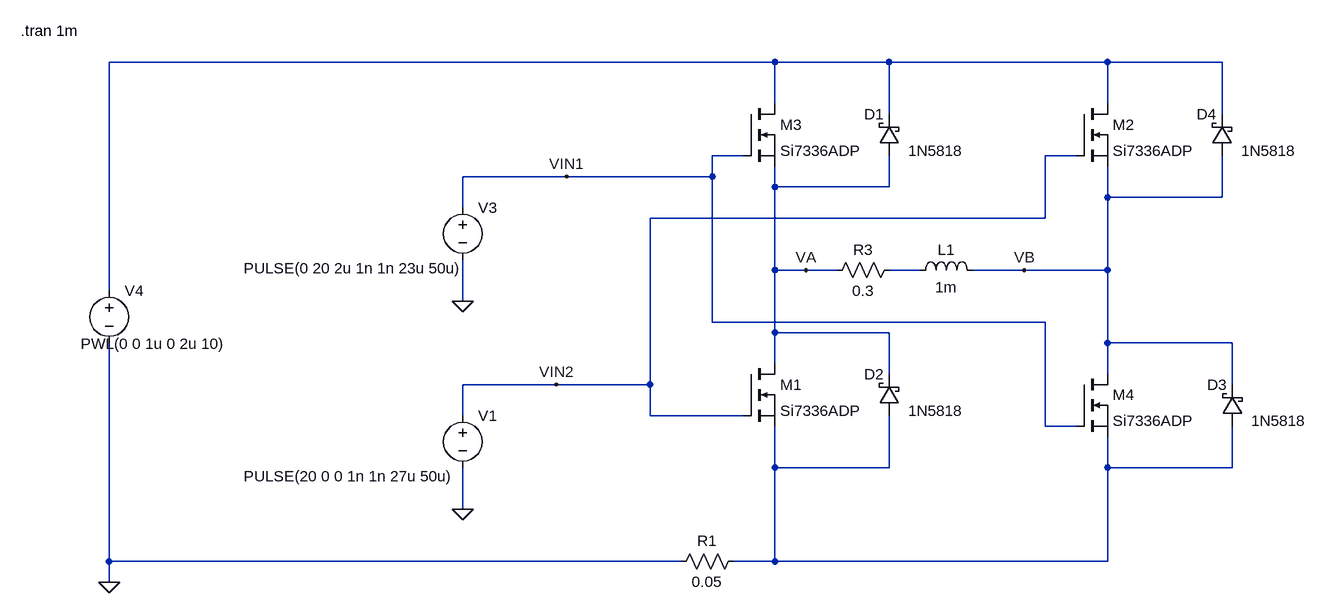
[diagram p0: schematic rl_pwm.asc]
rl_pwm.asc, the LTspice schematic file:
Version 4
SHEET 1 3012 680
WIRE 2192 -240 1168 -240
WIRE 2368 -240 2192 -240
WIRE 2704 -240 2368 -240
WIRE 2880 -240 2704 -240
WIRE 2192 -176 2192 -240
WIRE 2704 -176 2704 -240
WIRE 2368 -160 2368 -240
WIRE 2880 -160 2880 -240
WIRE 2144 -96 2096 -96
WIRE 2656 -96 2608 -96
WIRE 1872 -64 1712 -64
WIRE 2096 -64 2096 -96
WIRE 2096 -64 1872 -64
WIRE 2192 -48 2192 -80
WIRE 2368 -48 2368 -96
WIRE 2368 -48 2192 -48
WIRE 2704 -32 2704 -80
WIRE 2880 -32 2880 -96
WIRE 2880 -32 2704 -32
WIRE 1712 -16 1712 -64
WIRE 2608 0 2608 -96
WIRE 2608 0 2000 0
WIRE 2192 80 2192 -48
WIRE 2240 80 2192 80
WIRE 2288 80 2240 80
WIRE 2416 80 2368 80
WIRE 2576 80 2496 80
WIRE 2704 80 2704 -32
WIRE 2704 80 2576 80
WIRE 1168 112 1168 -240
WIRE 1712 128 1712 64
WIRE 2096 160 2096 -64
WIRE 2608 160 2096 160
WIRE 2192 176 2192 80
WIRE 2368 176 2192 176
WIRE 2704 192 2704 80
WIRE 2896 192 2704 192
WIRE 2192 224 2192 176
WIRE 2368 240 2368 176
WIRE 2704 240 2704 192
WIRE 1856 256 1712 256
WIRE 2000 256 2000 0
WIRE 2000 256 1856 256
WIRE 2896 256 2896 192
WIRE 1712 304 1712 256
WIRE 2000 304 2000 256
WIRE 2144 304 2000 304
WIRE 2608 320 2608 160
WIRE 2656 320 2608 320
WIRE 2192 384 2192 320
WIRE 2368 384 2368 304
WIRE 2368 384 2192 384
WIRE 2704 384 2704 336
WIRE 2896 384 2896 320
WIRE 2896 384 2704 384
WIRE 1712 448 1712 384
WIRE 1168 528 1168 192
WIRE 2048 528 1168 528
WIRE 2192 528 2192 384
WIRE 2192 528 2128 528
WIRE 2704 528 2704 384
WIRE 2704 528 2192 528
WIRE 1168 560 1168 528
FLAG 1712 128 0
FLAG 1168 560 0
FLAG 2240 80 VA
FLAG 2576 80 VB
FLAG 1872 -64 VIN1
FLAG 1712 448 0
FLAG 1856 256 VIN2
SYMBOL voltage 1712 -32 R0
WINDOW 3 -337 109 Left 2
WINDOW 123 0 0 Left 0
WINDOW 39 0 0 Left 0
SYMATTR Value PULSE(0 20 2u 1n 1n 23u 50u)
SYMATTR InstName V3
SYMBOL nmos 2656 240 R0
SYMATTR InstName M4
SYMATTR Value Si7336ADP
SYMBOL res 2384 64 R90
WINDOW 0 0 56 VBottom 2
WINDOW 3 32 56 VTop 2
SYMATTR InstName R3
SYMATTR Value 0.3
SYMBOL voltage 1168 96 R0
WINDOW 3 -44 97 Left 2
WINDOW 123 0 0 Left 0
WINDOW 39 0 0 Left 0
SYMATTR Value PWL(0 0 1u 0 2u 10)
SYMATTR InstName V4
SYMBOL nmos 2144 -176 R0
SYMATTR InstName M3
SYMATTR Value Si7336ADP
SYMBOL ind 2400 96 R270
WINDOW 0 32 56 VTop 2
WINDOW 3 5 56 VBottom 2
SYMATTR InstName L1
SYMATTR Value 1m
SYMBOL res 2144 512 R90
WINDOW 0 0 56 VBottom 2
WINDOW 3 32 56 VTop 2
SYMATTR InstName R1
SYMATTR Value 0.05
SYMBOL nmos 2144 224 R0
SYMATTR InstName M1
SYMATTR Value Si7336ADP
SYMBOL nmos 2656 -176 R0
SYMATTR InstName M2
SYMATTR Value Si7336ADP
SYMBOL voltage 1712 288 R0
WINDOW 3 -337 109 Left 2
WINDOW 123 0 0 Left 0
WINDOW 39 0 0 Left 0
SYMATTR Value PULSE(20 0 0 1n 1n 27u 50u)
SYMATTR InstName V1
SYMBOL schottky 2384 -96 R180
WINDOW 0 24 64 Left 2
WINDOW 3 -98 8 Left 2
SYMATTR InstName D1
SYMATTR Value 1N5818
SYMATTR Description Diode
SYMATTR Type diode
SYMBOL schottky 2384 304 R180
WINDOW 0 24 64 Left 2
WINDOW 3 -98 8 Left 2
SYMATTR InstName D2
SYMATTR Value 1N5818
SYMATTR Description Diode
SYMATTR Type diode
SYMBOL schottky 2912 320 R180
WINDOW 0 24 64 Left 2
WINDOW 3 -98 8 Left 2
SYMATTR InstName D3
SYMATTR Value 1N5818
SYMATTR Description Diode
SYMATTR Type diode
SYMBOL schottky 2896 -96 R180
WINDOW 0 24 64 Left 2
WINDOW 3 -98 8 Left 2
SYMATTR InstName D4
SYMATTR Value 1N5818
SYMATTR Description Diode
SYMATTR Type diode
TEXT 1032 -288 Left 2 !.tran 1m

The netlist it stands for:
* rl_pwm.asc
V3 VIN1 0 PULSE(0 20 2u 1n 1n 23u 50u)
M4 VB VIN1 N003 N003 Si7336ADP
R3 N002 VA 0.3
V4 N001 0 PWL(0 0 1u 0 2u 10)
M3 N001 VIN1 VA VA Si7336ADP
L1 N002 VB 1m
R1 N003 0 0.05
M1 VA VIN2 N003 N003 Si7336ADP
M2 N001 VIN2 VB VB Si7336ADP
V1 VIN2 0 PULSE(20 0 0 1n 1n 27u 50u)
D1 VA N001 1N5818
D2 N003 VA 1N5818
D3 N003 VB 1N5818
D4 VB N001 1N5818
.model D D
.lib standard.dio
.model NMOS NMOS
.model PMOS PMOS
.lib standard.mos
.tran 1m
.backanno
.end

* Results of the author's LTspice run, read from the files saved beside the schematic
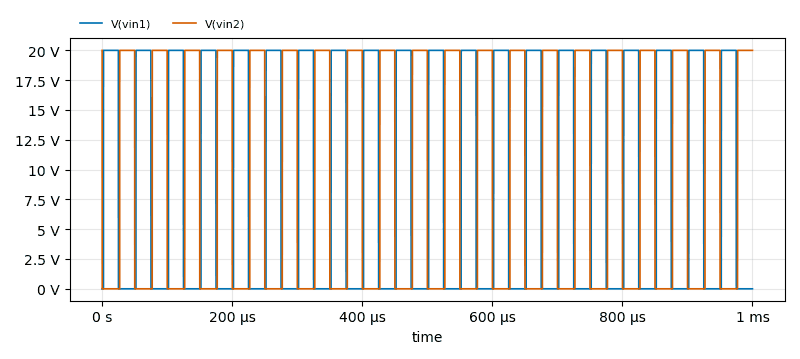
[diagram p1: Transient Analysis of rl_pwm.asc, plotted from the saved traces]
* Transient Analysis, 1 run:
*   V(vin1): min 0 V, max 20 V, average 9.2 V, rms 13.56 V, last 0 V
*   V(vin2): min 0 V, max 20 V, average 9.2 V, rms 13.56 V, last 20 V